# Altium schematic sheet K60 2014 12 12.SchDoc: 刘雯  关心男
size A3
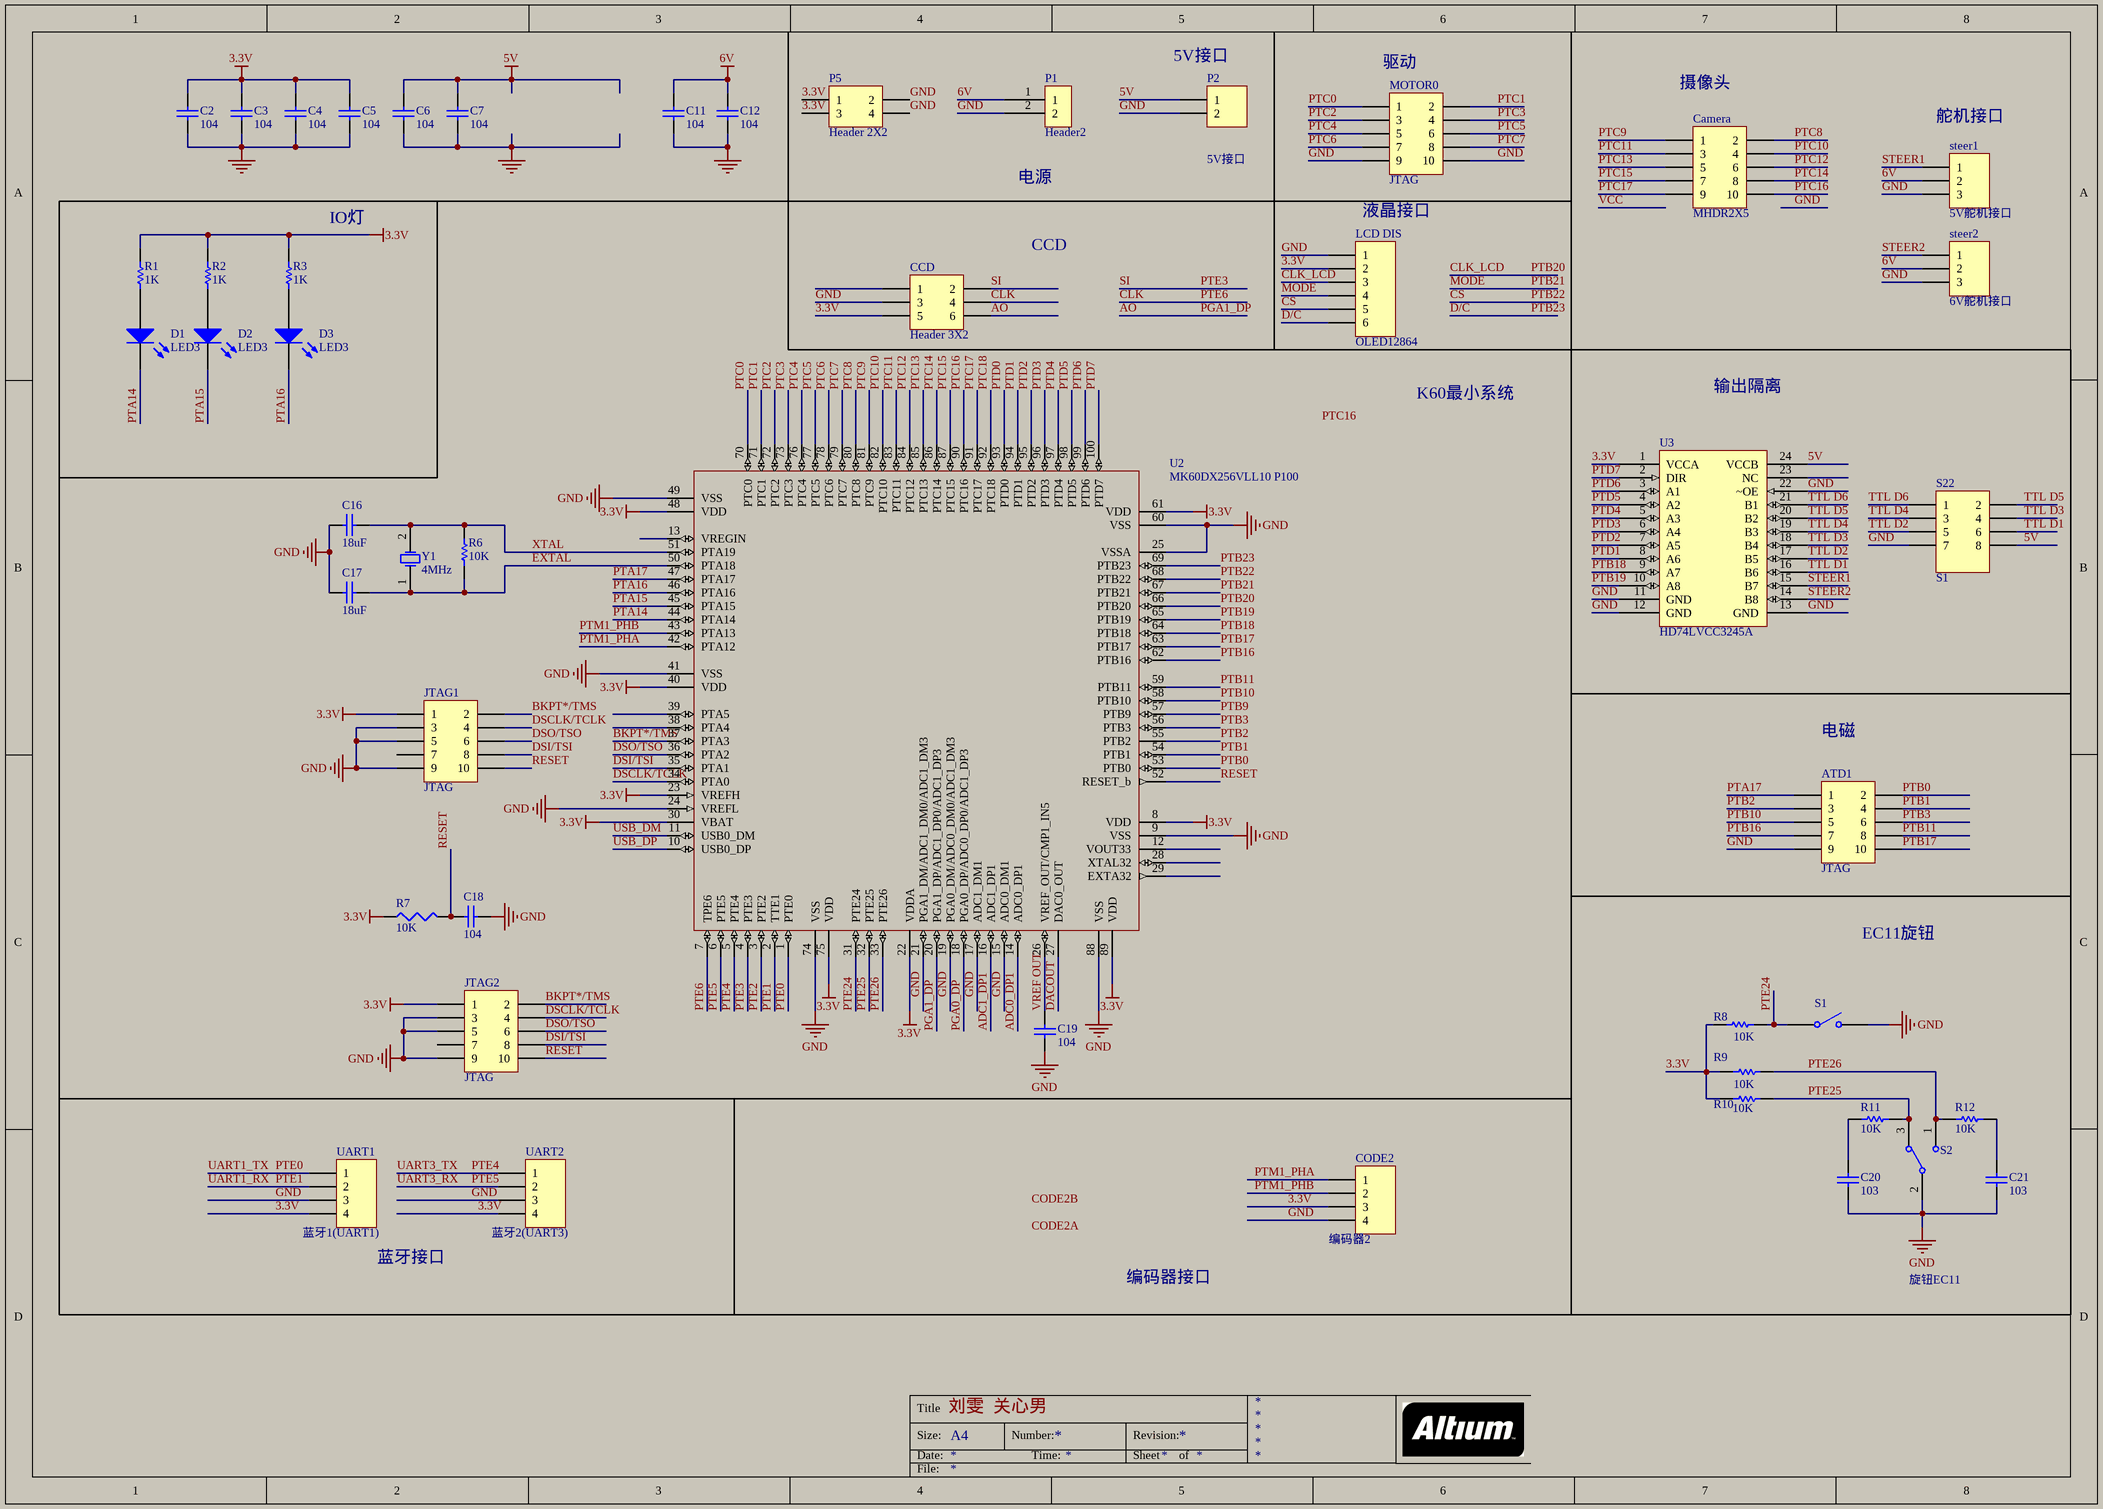
[diagram p0: K60 2014 12 12.SchDoc]

## Parts
ATD1  JTAG  [IDC10S]
C2  104  [0603]
C3  104  [0603]
C4  104  [0603]
C5  104  [0603]
C6  104  [0603]
C7  104  [0603]
C11  104  [0603]
C12  104  [0603]
C16  18uF  [0603]
C17  18uF  [0603]
C18  value 104  [0603]  (hidden comment: C1)
C19  value 104  [0603]  (hidden comment: C1)
C20  103  [0603]
C21  103  [0603]
Camera  MHDR2X5  [IDC10S]
CCD  Header 3X2  [HDR2X3]
CODE2  编码器2  [HDR1X4]
D1  LED3  [0805]
D2  LED3  [0805]
D3  LED3  [0805]
JTAG1  JTAG  [JTAG-2.0]
JTAG2  JTAG  [MHDR2X5]
LCD_DIS  OLED12864  [HDR1X6]
MOTOR0  JTAG  [IDC10S]
P1  Header2  [DIP2-2.54]
P2  5V接口  [HDR1X2]
P5  Header 2X2  [HDR2X2]
R1  1K  [0603]
R2  1K  [0603]
R3  1K  [0603]
R6  10K  [0603]
R7  value 10K  [0603]  (hidden comment: Res3)
R8  10K  [0603]
R9  10K  [0603]
R10  10K  [0603]
R11  10K  [0603]
R12  10K  [0603]
S1  (no value)  [Code_Switch]
S2  (no value)  [Code_Switch]
S22  S1  [IDC10S]
steer1  5V舵机接口  [HDR1X3]
steer2  6V舵机接口  [HDR1X3]
U2  MK60DX256VLL10 P100  [983-01_M]
U3  HD74LVCC3245A  [HD74LVCC3245A]
UART1  蓝牙1(UART1)  [HDR1X4]
UART2  蓝牙2(UART3)  [HDR1X4]
Y1  4MHz  [晶振11.2-4.7-3.6]

## Blocks framed on the sheet
液晶接口: LCD_DIS

## Nets
3.3V: C2.2 C3.2 C4.2 C5.2 CCD.5 CODE2.3 JTAG1.1 JTAG2.1 LCD_DIS.2 P5.1 P5.3 R1.2 R2.2 R3.2 R7.1 R8.1 R9.1 R10.1 U2.8(VDD) U2.22(VDDA) U2.23(VREFH) U2.30(VBAT) U2.40(VDD) U2.48(VDD) U2.61(VDD) U2.75(VDD) U2.89(VDD) U3.1(VCCA) UART1.4 UART2.4
5V: C6.2 C7.2 P2.1 S22.8 U3.24(VCCB)
6V: C11.2 C12.2 P1.1 steer1.2 steer2.2
GND: ATD1.9 C2.1 C3.1 C4.1 C5.1 C6.1 C7.1 C11.1 C12.1 C16.2 C17.2 C18.2 C19.1 C20.1 C21.1 CCD.3 CODE2.4 JTAG1.3 JTAG1.5 JTAG1.9 JTAG2.3 JTAG2.5 JTAG2.9 LCD_DIS.1 MOTOR0.9 MOTOR0.10 P1.2 P2.2 P5.2 P5.4 S1.2(NO) S2.2 S22.7 steer1.3 steer2.3 U2.9(VSS) U2.15(ADC0_DM1) U2.17(ADC1_DM1) U2.19(PGA0_DM/ADC0_DM0/ADC1_DM3) U2.21(PGA1_DM/ADC1_DM0/ADC1_DM3) U2.24(VREFL) U2.25(VSSA) U2.41(VSS) U2.49(VSS) U2.60(VSS) U2.74(VSS) U2.88(VSS) U3.11(GND) U3.12(GND) U3.13(GND) U3.22(~OE) UART1.3 UART2.3
ADC0_DP1: U2.14(ADC0_DP1)
ADC1_DP1: U2.16(ADC1_DP1)
AO: CCD.6 U2.20(PGA1_DP/ADC1_DP0/ADC1_DP3)  [also labelled PGA1_DP]
BKPT*/TMS: JTAG1.2 JTAG2.2 U2.37(PTA3)
CLK: CCD.4 U2.7(TPE6)  [also labelled PTE6]
CLK_LCD: LCD_DIS.3 U2.66(PTB20)  [also labelled PTB20]
CS: LCD_DIS.5 U2.68(PTB22)  [also labelled PTB22]
D/C: LCD_DIS.6 U2.69(PTB23)  [also labelled PTB23]
DACOUT: U2.27(DAC0_OUT)
DSCLK/TCLK: JTAG1.4 JTAG2.4 U2.34(PTA0)
DSI/TSI: JTAG1.8 JTAG2.8 U2.35(PTA1)
DSO/TSO: JTAG1.6 JTAG2.6 U2.36(PTA2)
EXTAL: C17.1 R6.1 U2.50(PTA18) Y1.1(OSC1)
MODE: LCD_DIS.4 U2.67(PTB21)  [also labelled PTB21]
PGA0_DP: U2.18(PGA0_DP/ADC0_DP0/ADC1_DP3)
PTA14: D1.2(K) U2.44(PTA14)
PTA15: D2.2(K) U2.45(PTA15)
PTA16: D3.2(K) U2.46(PTA16)
PTA17: ATD1.1 U2.47(PTA17)
PTB0: ATD1.2 U2.53(PTB0)
PTB1: ATD1.4 U2.54(PTB1)
PTB2: ATD1.3 U2.55(PTB2)
PTB3: ATD1.6 U2.56(PTB3)
PTB9: U2.57(PTB9)
PTB10: ATD1.5 U2.58(PTB10)
PTB11: ATD1.8 U2.59(PTB11)
PTB16: ATD1.7 U2.62(PTB16)
PTB17: ATD1.10 U2.63(PTB17)
PTB18: U2.64(PTB18) U3.9(A7)
PTB19: U2.65(PTB19) U3.10(A8)
PTC0: MOTOR0.1 U2.70(PTC0)
PTC1: MOTOR0.2 U2.71(PTC1)
PTC2: MOTOR0.3 U2.72(PTC2)
PTC3: MOTOR0.4 U2.73(PTC3)
PTC4: MOTOR0.5 U2.76(PTC4)
PTC5: MOTOR0.6 U2.77(PTC5)
PTC6: MOTOR0.7 U2.78(PTC6)
PTC7: MOTOR0.8 U2.79(PTC7)
PTC8: Camera.2 U2.80(PTC8)
PTC9: Camera.1 U2.81(PTC9)
PTC10: Camera.4 U2.82(PTC10)
PTC11: Camera.3 U2.83(PTC11)
PTC12: Camera.6 U2.84(PTC12)
PTC13: Camera.5 U2.85(PTC13)
PTC14: Camera.8 U2.86(PTC14)
PTC15: Camera.7 U2.87(PTC15)
PTC16: Camera.10 U2.90(PTC16)
PTC17: Camera.9 U2.91(PTC17)
PTC18: U2.92(PTC18)
PTD0: U2.93(PTD0)
PTD1: U2.94(PTD1) U3.8(A6)
PTD2: U2.95(PTD2) U3.7(A5)
PTD3: U2.96(PTD3) U3.6(A4)
PTD4: U2.97(PTD4) U3.5(A3)
PTD5: U2.98(PTD5) U3.4(A2)
PTD6: U2.99(PTD6) U3.3(A1)
PTD7: U2.100(PTD7) U3.2(DIR)
PTE0: U2.1(PTE0) UART1.1  [also labelled UART1_TX]
PTE1: U2.2(TTE1) UART1.2  [also labelled UART1_RX]
PTE2: U2.3(PTE2)
PTE3: CCD.2 U2.4(PTE3)  [also labelled SI]
PTE4: U2.5(PTE4) UART2.1  [also labelled UART3_TX]
PTE5: U2.6(PTE5) UART2.2  [also labelled UART3_RX]
PTE24: R8.2 S1.1(COMMON) U2.31(PTE24)
PTE25: R10.2 R11.2 S2.3 U2.32(PTE25)
PTE26: R9.2 R12.1 S2.1 U2.33(PTE26)
PTM1_PHA: CODE2.1 U2.42(PTA12)
PTM1_PHB: CODE2.2 U2.43(PTA13)
RESET: C18.1 JTAG1.10 JTAG2.10 R7.2 U2.52(RESET_b)
STEER1: steer1.1 U3.15(B7)
STEER2: steer2.1 U3.14(B8)
TTL D1: S22.6 U3.16(B6)
TTL D2: S22.5 U3.17(B5)
TTL D3: S22.4 U3.18(B4)
TTL D4: S22.3 U3.19(B3)
TTL D5: S22.2 U3.20(B2)
TTL D6: S22.1 U3.21(B1)
USB_DM: U2.11(USB0_DM)
USB_DP: U2.10(USB0_DP)
VREF OUT: C19.2 U2.26(VREF_OUT/CMP1_IN5)
XTAL: C16.1 R6.2 U2.51(PTA19) Y1.2(OSC2)
NetC20_2: C20.2 R11.1
NetC21_2: C21.2 R12.2
NetD1_1: D1.1(A) R1.1
NetD2_1: D2.1(A) R2.1
NetD3_1: D3.1(A) R3.1

Not connected (* = marked no-connect by the designer): CCD 1; JTAG1 7; JTAG2 7; U2 12(VOUT33) 13(VREGIN) 28(XTAL32) 29(EXTA32) 38(PTA4) 39(PTA5); U3 23(NC)

## Notes on the sheet
- (near P2) 5V接口
- (near MOTOR0) 驱动
- (near Camera) 摄像头
- 电源
- (near steer1) 舵机接口
- (near R3) IO灯
- CCD
- K60最小系统
- 输出隔离
- 电磁
- EC11旋钮
- (near UART1) 蓝牙接口
- 编码器接口
- 旋钮EC11
- Labels drawn without touching a wire or pin: CODE2A, CODE2B, PTC16
- Title
- Size:
- Date:
- A4
- Number:
- Time:
- Revision:
- Sheet
- of
- File:

## Library data of the parts
ATD1 Camera JTAG1 JTAG2 MOTOR0 S22 = MHDR2X5: Header, 5-Pin, Dual row; LatestRevisionDate: 17-Jul-2002; LatestRevisionNote: Re-released for DXP Platform.; Publisher: Altium Limited
C2-C7 C11 C12 C16 C17 C20 C21 = Cap 0603: Capacitor
C18 C19 = Cap Semi: Capacitor (Semiconductor SIM Model); Published: 8-Jun-2000; LatestRevisionDate: 17-Jul-2002; LatestRevisionNote: Re-released for DXP Platform.; PackageReference: C1206; Publisher: Altium Limited
CCD = Header 3X2: Header, 3-Pin, Dual row; LatestRevisionDate: 17-Jul-2002; LatestRevisionNote: Re-released for DXP Platform.; Publisher: Altium Limited
CODE2 UART1 UART2 = Header 4: Header, 4-Pin; LatestRevisionDate: 17-Jul-2002; LatestRevisionNote: Re-released for DXP Platform.; Publisher: Altium Limited
D1-D3 = LED3: Typical BLUE SiC LED; Published: 8-Jun-2000; LatestRevisionDate: 17-Dec-2003; LatestRevisionNote: PCB Footprint replaced.; DatasheetDocument: 16-Apr-2002; PackageDocument: 16-Apr-2002; PackageReference: 3.5X2.8X1.9; Publisher: Altium Limited
LCD_DIS = Header 6: Header, 6-Pin; LatestRevisionDate: 17-Jul-2002; LatestRevisionNote: Re-released for DXP Platform.; Publisher: Altium Limited
P2 = Header 2: Header, 2-Pin; LatestRevisionDate: 17-Jul-2002; LatestRevisionNote: Re-released for DXP Platform.; Publisher: Altium Limited
P5 = Header 2X2: Header, 2-Pin, Dual row; LatestRevisionDate: 17-Jul-2002; LatestRevisionNote: Re-released for DXP Platform.; Publisher: Altium Limited
R1-R3 R6 R8-R12 = Res0603: Resistor
R7 = Res3: Resistor; Published: 8-Jun-2000; LatestRevisionDate: 04-Mar-2005; LatestRevisionNote: PCB Footprint replaced.; PackageReference: J1-0603; Publisher: Altium Limited
S1 = SW-SPST: Single-Pole, Single-Throw Switch; pin to pad: 1>4 2>5; Published: 24-Mar-1999; LatestRevisionDate: 17-Jul-2002; LatestRevisionNote: Re-released for DXP Platform.; PackageReference: SPST-2; Publisher: Altium Limited
S2 = SW-SPDT: SPDT Subminiature Toggle Switch, Right Angle Mounting, Vertical Actuation; Published: 24-Mar-1999; LatestRevisionDate: 17-Dec-2003; LatestRevisionNote: Schematic revised, PCB Footprint replaced.; DatasheetVersion: 05-Dec-2000; PackageReference: TL36WW15050; Publisher: Altium Limited; PackageDescription: Switch; 4 Leads; ComponentLink1Description: Manufacturer Link; ComponentLink1URL: http://www.apem.com
steer1 steer2 = Header 3: Header, 3-Pin; LatestRevisionDate: 17-Jul-2002; LatestRevisionNote: Re-released for DXP Platform.; Publisher: Altium Limited
U2 = MC68LC302PU16: Low Cost Integrated Multiprotocol Processor; Rule: PcbType=ProtelPcb; Published: 21-Mar-2003; LatestRevisionDate: 13-Apr-2006; LatestRevisionNote: IPC-7351 Footprint Added.; DatasheetVersion: Jan-1995; PackageVersion: 1999; PackageReference: 983-01; Publisher: Altium Limited; PackageDescription: 100-Pin Thin Quad Flat Pack 0.5 mm Pitch; ComponentLink1Description: Manufacturer Link; ComponentLink1URL: http://www.freescale.com/; ComponentLink2Description: Datasheet; ComponentLink2URL: http://www.freescale.com/files/netcomm/doc/data_sheet/MC68LC302.pdf
U3 = HD74LVCC3245A: Octal Bus Transceiver with adjustable output voltage  and 3-state Outputs
Y1 = XTAL: Crystal Oscillator; Published: 8-Jun-2000; LatestRevisionDate: 17-Jul-2002; LatestRevisionNote: Re-released for DXP Platform.; PackageReference: R38; Publisher: Altium Limited